# EAGLE design rev00 (EAGLE 6.5.0)
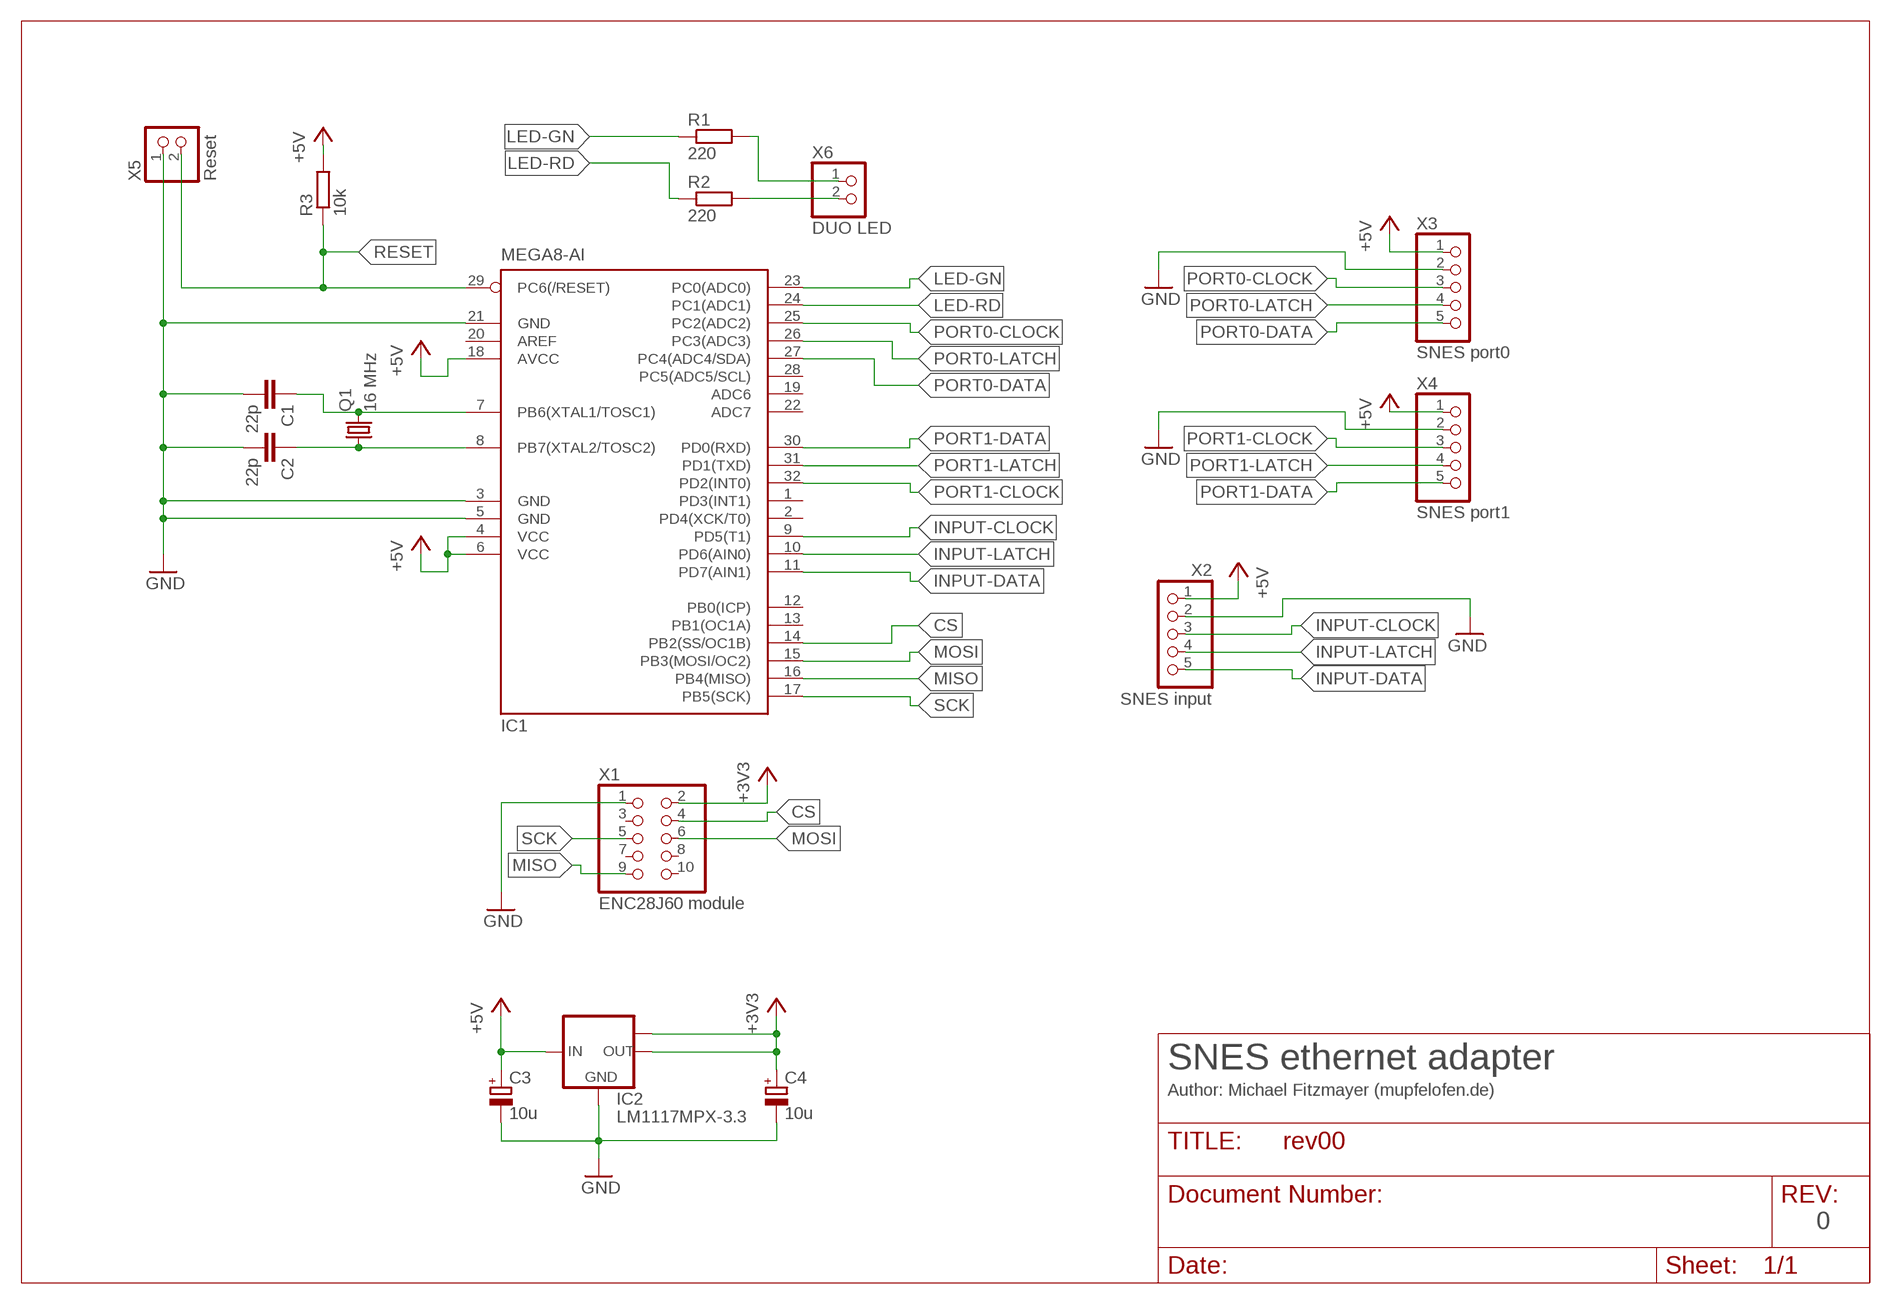
[diagram p0: schematic, sheet 1]

## Parts
C1  22p  C-EUC1206  [C1206]
C2  22p  C-EUC1206  [C1206]
C3  10u  CPOL-EUC/6032-28R  [C/6032-28R]
C4  10u  CPOL-EUC/6032-28R  [C/6032-28R]
IC1  MEGA8-AI  [TQFP32-08]
IC2  LM1117MPX-3.3  [SOT223]
Q1  16 MHz  CRYSTALSM49  [SM49]
R1  220  R-EU_R1206  [R1206]
R2  220  R-EU_R1206  [R1206]
R3  10k  R-EU_R1206  [R1206]
X1  ENC28J60 module  PINHD-2X5_2.54-SMD  [2X05SMD]
X2  SNES input  PINHD-1X5_2.54-SMD  [1X05SMD]
X3  SNES port0  PINHD-1X5_2.54-SMD  [1X05SMD]
X4  SNES port1  PINHD-1X5_2.54-SMD  [1X05SMD]
X5  Reset  PINHD-1X2_2.54-SMD  [1X02SMD]
X6  DUO LED  PINHD-1X2_2.54-SMD  [1X02SMD]

## Nets
+3V3: C4.+ IC2.2(OUT) IC2.TAB(OUT1) X1.2
+5V: C3.+ IC1.4(VCC) IC1.6(VCC) IC1.18(AVCC) IC2.3(IN) R3.2 X2.1 X3.1 X4.1
CS: IC1.14(PB2(SS/OC1B)) X1.4
GND: C1.2 C2.2 C3.- C4.- IC1.3(GND) IC1.5(GND) IC1.21(GND) IC2.1(GND) X1.1 X2.2 X3.2 X4.2 X5.1
INPUT-CLOCK: IC1.9(PD5(T1)) X2.3
INPUT-DATA: IC1.11(PD7(AIN1)) X2.5
INPUT-LATCH: IC1.10(PD6(AIN0)) X2.4
LED-GN: IC1.23(PC0(ADC0)) R1.1
LED-RD: IC1.24(PC1(ADC1)) R2.1
MISO: IC1.16(PB4(MISO)) X1.9
MOSI: IC1.15(PB3(MOSI/OC2)) X1.6
N$1: R2.2 X6.2
N$2: R1.2 X6.1
N$4: C1.1 IC1.7(PB6(XTAL1/TOSC1)) Q1.2
N$5: C2.1 IC1.8(PB7(XTAL2/TOSC2)) Q1.1
PORT0-CLOCK: IC1.25(PC2(ADC2)) X3.3
PORT0-DATA: IC1.27(PC4(ADC4/SDA)) X3.5
PORT0-LATCH: IC1.26(PC3(ADC3)) X3.4
PORT1-CLOCK: IC1.32(PD2(INT0)) X4.3
PORT1-DATA: IC1.30(PD0(RXD)) X4.5
PORT1-LATCH: IC1.31(PD1(TXD)) X4.4
RESET: IC1.29(PC6(/RESET)) R3.1 X5.2
SCK: IC1.17(PB5(SCK)) X1.5
Unconnected: IC1.1(PD3(INT1)) IC1.2(PD4(XCK/T0)) IC1.12(PB0(ICP)) IC1.13(PB1(OC1A)) IC1.19(ADC6) IC1.20(AREF) IC1.22(ADC7) IC1.28(PC5(ADC5/SCL)) X1.3 X1.7 X1.8 X1.10

## Notes on the sheet
- SNES ethernet adapter
- Author: Michael Fitzmayer (mupfelofen.de)
- 0

## Library data of the parts
C1 C2 = resistor:C-EU: CAPACITOR, European symbol
C3 C4 = resistor:CPOL-EU: POLARIZED CAPACITOR, European symbol
IC1 = atmel:MEGA8: MICROCONTROLLER 8 Kbytes FLASH, 1 kbytes SRAM, 512 bytes EEPROM, USART, 6-channel 10 bit ADC, 2-channel 8 bit ADC Pin compatible with Atmega48, ATMega88, ATMega168 Source: avr.lbr; MPN: ATMEGA8-16AU; OC_FARNELL: 9171371; OC_NEWARK: 73M8863
IC2 = lm1117:LM1117MPX-*
Q1 = crystal:CRYSTAL: CRYSTAL; OC_FARNELL: unknown; OC_NEWARK: unknown
R1-R3 = resistor:R-EU_: RESISTOR, European symbol
X1 = pinhead:PINHD-2X5: PIN HEADER
X2-X4 = pinhead:PINHD-1X5: PIN HEADER
X5 X6 = pinhead:PINHD-1X2: PIN HEADER

## Board
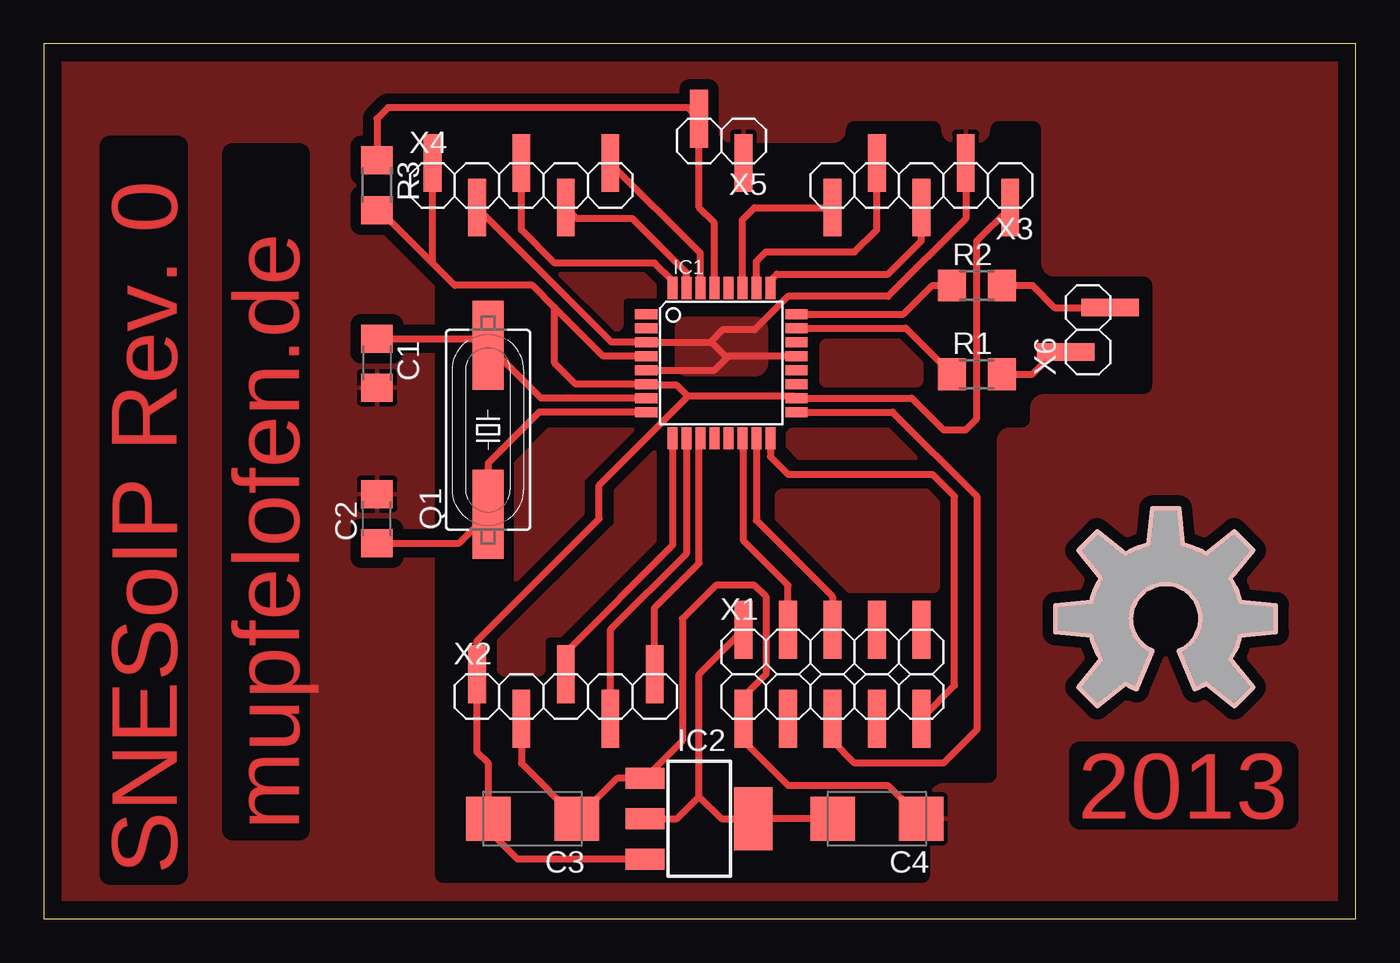
[diagram p1: board, top side]

Size 75 x 50 mm. Coordinates in mm from the lower left corner, seen from the top.
Outline: 0,0 75,0 75,50 0,50 0,0
Copper layers (1*16): Top 0.035mm / dielectric 1.5mm / Bottom 0.035mm
Design rules "default": minimum track width 10mil, minimum drill 24mil, track to track 8mil, track to pad 8mil, pad to pad 8mil, via to via 8mil, smd to smd 8mil, copper to edge 40mil, drill to drill 8mil, minimum pad ring 10mil, minimum via ring 8mil, stop-mask expansion 4mil, vias tented up to drill 0mil, thermal gap 10mil

### Footprints (pad centres in the part's own frame; a part is rotated, then mirrored left to right if it is on the bottom)
C1206 = smd 1.6 x 1.8: 1 -1.4,0; 2 1.4,0
C/6032-28R = smd 2.55 x 2.5: + 2.525,0; - -2.525,0
TQFP32-08 = smd 1.27 x 0.559: 1 -4.293,2.8; 2 -4.293,2; 3 -4.293,1.2; 4 -4.293,0.4; 5 -4.293,-0.4; 6 -4.293,-1.2; 7 -4.293,-2; 8 -4.293,-2.8; 17 4.293,-2.8; 18 4.293,-2; 19 4.293,-1.2; 20 4.293,-0.4; 21 4.293,0.4; 22 4.293,1.2; 23 4.293,2; 24 4.293,2.8 | smd 0.559 x 1.27: 9 -2.8,-4.293; 10 -2,-4.293; 11 -1.2,-4.293; 12 -0.4,-4.293; 13 0.4,-4.293; 14 1.2,-4.293; 15 2,-4.293; 16 2.8,-4.293; 25 2.8,4.293; 26 2,4.293; 27 1.2,4.293; 28 0.4,4.293; 29 -0.4,4.293; 30 -1.2,4.293; 31 -2,4.293; 32 -2.8,4.293
SOT223 = smd 1.219 x 2.235: 1 -2.311,-3.099; 2 0,-3.099; 3 2.311,-3.099 | smd 3.6 x 2.2: TAB 0,3.099
SM49 = smd 5.08 x 1.778: 1 -4.826,0; 2 4.826,0
R1206 = smd 1.6 x 1.803: 1 -1.422,0; 2 1.422,0
2X05SMD = smd 1.016 x 3.302: 1 -1.27,-3.81; 2 -1.27,1.27; 3 1.27,-3.81; 4 1.27,1.27; 5 3.81,-3.81; 6 3.81,1.27; 7 6.35,-3.81; 8 6.35,1.27; 9 8.89,-3.81; 10 8.89,1.27
1X05SMD = smd 1.016 x 3.302: 1 -1.27,1.27; 2 1.27,-1.27; 3 3.81,1.27; 4 6.35,-1.27; 5 8.89,1.27
1X02SMD = smd 1.016 x 3.302: 1 -1.27,1.27; 2 1.27,-1.27

### Placement (x,y rotation side)
C1  19.05,31.75 270 top
C2  19.05,22.86 90 top
C3  27.94,5.71 180 top
C4  47.62,5.71 180 top
IC1  38.73,31.75 0 top
IC2  37.47,5.71 270 top
Q1  25.4,27.94 90 top
R1  53.34,31.11 0 top
R2  53.34,36.2 0 top
R3  19.05,41.91 270 top
X1  41.27,15.24 0 top
X2  26.04,12.7 0 top
X3  53.98,41.91 180 top
X4  23.5,41.91 0 top
X5  38.73,44.45 180 top
X6  59.69,33.66 90 top

### Tracks (layer width: path | path; a pad name or v marks a point on that pad's centre or on a via)
+3V3
  Top 0.406: IC2.2 36.2,5.71 37.47,6.99 | 37.47,6.99 37.47,13.97 X1.2 | 37.47,6.99 38.73,5.71 IC2.TAB C4.+
+5V
  Top 0.406: 36.83,29.84 36.2,30.48 34.51,30.48 IC1.6 30.41,30.55 29.21,31.75 29.21,34.92 | 36.83,29.84 42.93,29.84 IC1.18 49.62,29.75 51.44,27.94 52.7,27.94 53.34,28.57 53.34,38.73 X3.1 | 29.21,34.92 27.94,36.2 23.5,36.2 22.23,37.47 | 22.23,37.47 X4.1 | IC1.4 31.98,32.15 29.21,34.92 | IC2.3 27.08,3.4 25.4,5.08 25.4,5.7 C3.+ 25.41,8.88 24.77,9.53 X2.1 24.77,15.88 31.75,22.86 31.75,24.77 36.83,29.84 | R3.2 19.2,40.49 22.23,37.47
COPPER
  pour Top: 42.55,24.45 50.48,24.45 51.12,23.81 51.12,19.05 arc-90 50.8,18.73 46.04,18.73 41.91,22.86 41.91,24.13 arc-90 42.23,24.45
  pour Top: 42.55,27.62 arc-90 42.86,27.94 48.26,27.94 49.85,26.35 43.18,26.35 42.55,26.99
  pour Top: 44.45,32.7 arc-90 44.77,33.02 48.9,33.02 50.16,31.75 50.16,30.8 arc-90 49.85,30.48 44.77,30.48 arc-90 44.45,30.8
  pour Top: 29.53,36.83 34.29,36.83 34.92,36.2 34.92,35.56 33.34,35.56 arc90 33.02,35.24 33.02,33.97 arc-90 32.7,33.66
  pour Top: 34.92,26.67 32.7,24.45 32.7,22.54 26.04,15.88 26.04,14.29 arc90 26.35,13.97 28.26,13.97 arc90 28.57,14.29 28.57,15.88 arc-90 28.89,16.19 29.53,16.19 34.92,21.59
  pour Top: 26.99,24.13 26.99,26.04 28.89,27.94 33.66,27.94 30.8,25.08 30.8,23.18 26.99,19.37
CS
  Top 0.406: X1.4 42.55,19.05 40.01,21.59 40.01,27.39 IC1.14
GND
  Top 0.406: IC1.5 38.34,31.35 39.05,32.07 | IC1.21 39.13,32.15 39.05,32.07 | 38.1,32.95 IC1.3 32.45,32.95 X4.2 | 38.1,32.95 38.17,32.95 39.05,32.07 | X3.2 52.7,40.01 48.26,35.56 42.55,35.56 40.64,33.66 38.8,33.66 38.1,32.95 | C4.- 48.24,7.62 42.55,7.62 40.01,10.16 X1.1 40.01,12.7 41.27,13.97 41.27,18.41 40.64,19.05 38.42,19.05 36.51,17.14 36.51,10.17 IC2.1 32.78,8.03 C3.- 27.3,8.88 X2.2
  pour Top (isolate 0.254): 41.27,33.66 41.27,31.75 arc-90 40.64,31.11 36.83,31.11 arc-90 36.2,31.75 36.2,33.66 arc-90 36.83,34.29 40.64,34.29 arc-90
  pour Top (isolate 0.61): -0.64,50.8 38.73,50.8 38.73,45.09 arc-90 38.1,44.45 22.23,44.45 22.23,2.54 arc90 22.86,1.91 38.73,1.91 38.73,-0.64 -0.64,-0.64
  pour Top (isolate 0.61): 75.56,50.8 38.73,50.8 38.73,45.09 arc90 39.37,44.45 45.09,44.45 arc90 45.72,45.09 arc-90 46.35,45.72 50.8,45.72 arc-90 51.44,45.09 arc90 52.07,44.45 53.34,44.45 arc90 53.98,45.09 arc-90 54.61,45.72 56.52,45.72 arc-90 57.15,45.09 57.15,37.47 arc90 57.78,36.83 62.87,36.83 arc-90 63.5,36.2 63.5,30.48 arc-90 62.87,29.84 57.15,29.84 arc90 56.52,29.21 56.52,28.57 arc-90 55.88,27.94 55.24,27.94 arc90 54.61,27.3 54.61,8.26 arc-90 53.98,7.62 51.44,7.62 arc90 50.8,6.99 50.8,2.54 arc-90 50.16,1.91 38.1,1.91 38.1,-0.64 75.56,-0.64
INPUT-CLOCK
  Top 0.406: IC1.9 35.94,21.33 29.84,15.24 X2.3
INPUT-DATA
  Top 0.406: X2.5 34.92,17.78 37.47,20.32 37.47,27.39 IC1.11
INPUT-LATCH
  Top 0.406: IC1.10 36.73,20.86 32.38,16.51 X2.4
LED-GN
  Top 0.406: IC1.23 49.28,33.75 R1.1
LED-RD
  Top 0.406: IC1.24 49.16,34.55 50.8,36.2 R2.1
MISO
  Top 0.406: X1.9 52.07,13.34 52.07,24.13 50.8,25.4 42.55,25.4 41.53,26.41 IC1.16
MOSI
  Top 0.406: IC1.15 40.73,22.77 45.09,18.41 X1.6
N$1
  Top 0.406: R2.2 56.52,36.2 57.78,34.92 X6.2
N$2
  Top 0.406: R1.2 56.52,31.11 57.78,32.38 X6.1
N$3
  Top 0.254: 65.81,13.11 arc9 66.45,13.44 68.04,12.14 69.14,13.24 67.84,14.83 arc19 68.39,16.16 70.44,16.37 70.44,17.92 68.39,18.13 arc19 67.84,19.46 69.14,21.05 68.04,22.15 66.45,20.85 arc19 65.12,21.4 64.91,23.45 63.36,23.45 63.15,21.4 arc19 61.82,20.85 60.23,22.15 59.13,21.05 60.43,19.46 arc19 59.88,18.13 57.83,17.92 57.83,16.37 59.88,16.16 arc19 60.43,14.83 59.13,13.24 60.23,12.14 61.82,13.44 arc9 62.46,13.11 63.38,15.31 arc-68 62.15,17.14 arc-248 64.89,15.31 65.81,13.11
N$4
  Top 0.406: IC1.7 28.42,29.75 Q1.2 25.02,33.15 C1.1
N$5
  Top 0.406: IC1.8 28.32,28.95 25.4,26.04 Q1.1 23.75,21.46 C2.1
PORT0-CLOCK
  Top 0.406: IC1.25 41.53,36.45 41.91,36.83 48.26,36.83 50.16,38.73 X3.3
PORT0-DATA
  Top 0.406: IC1.27 39.94,39.94 40.64,40.64 X3.5
PORT0-LATCH
  Top 0.406: IC1.26 40.73,37.56 41.27,38.1 46.35,38.1 47.62,39.37 X3.4
PORT1-CLOCK
  Top 0.406: IC1.32 35.94,36.45 34.92,37.47 29.21,37.47 27.3,39.37 X4.3
PORT1-DATA
  Top 0.406: IC1.30 37.53,38.03 X4.5
PORT1-LATCH
  Top 0.406: IC1.31 36.73,36.92 33.66,40.01 30.48,40.01 X4.4
RESET
  Top 0.406: IC1.29 38.34,39.77 37.47,40.64 X5.2 | 37.47,46.99 X5.2 | X5.2 36.83,46.35 19.68,46.35 19.05,45.72 R3.1
SCK
  Top 0.406: X1.5 45.09,10.16 46.35,8.89 51.44,8.89 53.34,10.79 53.34,24.13 48.52,28.95 IC1.17

### Text on the board
Top: 2013 | mupfelofen.de | SNESoIP Rev. 0